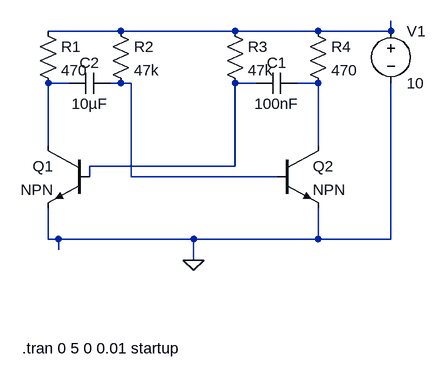
[diagram p0: schematic Astable-Multivibrator.asc]
Astable-Multivibrator.asc, the LTspice schematic file:
Version 4
SHEET 1 880 680
WIRE 112 96 0 96
WIRE 288 96 112 96
WIRE 416 96 288 96
WIRE 528 96 528 80
WIRE 528 96 416 96
WIRE 32 176 0 176
WIRE 112 176 96 176
WIRE 128 176 112 176
WIRE 320 176 288 176
WIRE 416 176 384 176
WIRE 0 272 0 176
WIRE 416 272 416 176
WIRE 288 304 288 176
WIRE 288 304 64 304
WIRE 64 320 64 304
WIRE 128 320 128 176
WIRE 352 320 128 320
WIRE 0 416 0 368
WIRE 16 416 0 416
WIRE 224 416 16 416
WIRE 416 416 416 368
WIRE 416 416 224 416
WIRE 528 416 528 176
WIRE 528 416 416 416
WIRE 16 432 16 416
WIRE 224 448 224 416
FLAG 224 448 0
SYMBOL res -16 80 R0
SYMATTR InstName R1
SYMATTR Value 470
SYMBOL res 96 80 R0
SYMATTR InstName R2
SYMATTR Value 47k
SYMBOL res 272 80 R0
SYMATTR InstName R3
SYMATTR Value 47k
SYMBOL res 400 80 R0
SYMATTR InstName R4
SYMATTR Value 470
SYMBOL voltage 528 80 R0
WINDOW 123 0 0 Left 0
WINDOW 39 0 0 Left 0
SYMATTR InstName V1
SYMATTR Value 10
SYMBOL npn 64 272 M0
SYMATTR InstName Q1
SYMBOL npn 352 272 R0
SYMATTR InstName Q2
SYMBOL cap 384 160 R90
WINDOW 0 0 32 VBottom 2
WINDOW 3 32 32 VTop 2
SYMATTR InstName C1
SYMATTR Value 100nF
SYMBOL cap 96 192 M270
WINDOW 0 32 32 VTop 2
WINDOW 3 0 32 VBottom 2
SYMATTR InstName C2
SYMATTR Value 10µF
TEXT -40 584 Left 2 !.tran 0 5 0 0.01 startup

The netlist it stands for:
* Astable-Multivibrator.asc
R1 N001 N002 470
R2 N001 N003 47k
R3 N001 N004 47k
R4 N001 N005 470
V1 N001 0 10
Q1 N002 N004 0 0 NPN
Q2 N005 N003 0 0 NPN
C1 N005 N004 100nF
C2 N003 N002 10µF
.model NPN NPN
.model PNP PNP
.lib standard.bjt
.tran 0 5 0 0.01 startup
.backanno
.end